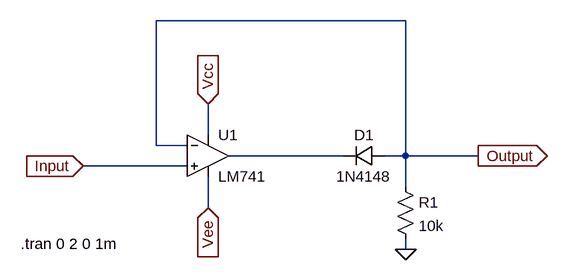
[diagram p0: schematic ReLU.asc]
ReLU.asc, the LTspice schematic file:
Version 4.1
SHEET 1 880 680
WIRE 544 -32 160 -32
WIRE 240 144 240 96
WIRE 160 160 160 -32
WIRE 208 160 160 160
WIRE 448 176 272 176
WIRE 544 176 544 -32
WIRE 544 176 512 176
WIRE 656 176 544 176
WIRE 208 192 48 192
WIRE 544 224 544 176
WIRE 240 256 240 208
WIRE 544 320 544 304
FLAG 544 320 0
FLAG 48 192 Input
IOPIN 48 192 In
FLAG 656 176 Output
IOPIN 656 176 Out
FLAG 240 96 Vcc
IOPIN 240 96 In
FLAG 240 256 Vee
IOPIN 240 256 In
SYMBOL lib\\lib\\sym\\OpAmps\\LM741 240 112 R0
SYMATTR InstName U1
SYMBOL res 528 208 R0
SYMATTR InstName R1
SYMATTR Value 10k
SYMBOL diode 512 160 R90
WINDOW 0 0 32 VBottom 2
WINDOW 3 32 32 VTop 2
SYMATTR InstName D1
SYMATTR Value 1N4148
TEXT -48 312 Left 2 !.tran 0 2 0 1m

The netlist it stands for:
* ReLU.asc
X§U1 Input Output Vcc Vee N001 LM741  ; pins In+ In- V+ V- OUT
R1 Output 0 10k
D1 Output N001 1N4148
.model D D
.lib standard.dio
.tran 0 2 0 1m
.lib LM741.lib
.backanno
.end